# EasyEDA Pro project ProPrj_CraftVia-MakerCard-S-v1-Rev0_2026-09-30.epro, board PCB1
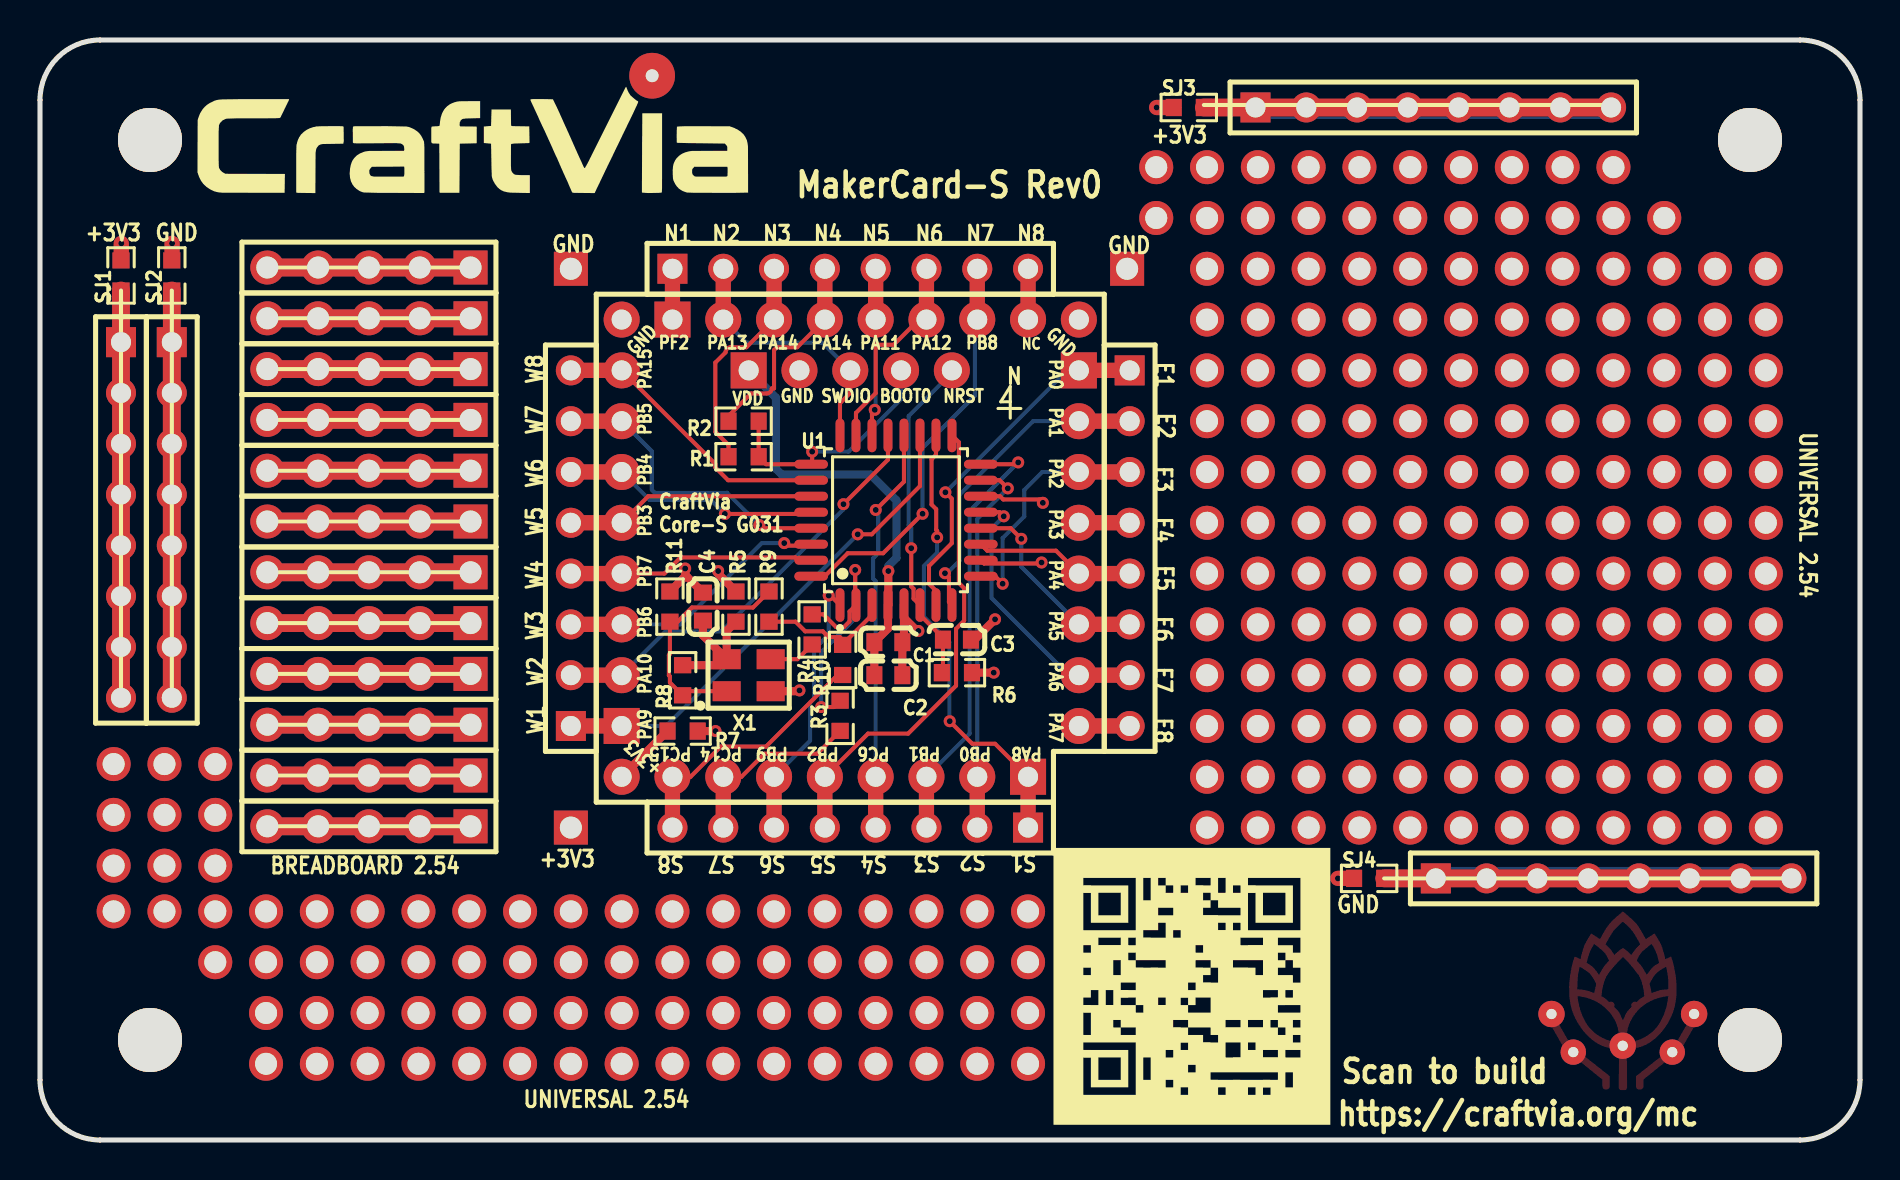
[diagram p3: board, top side]
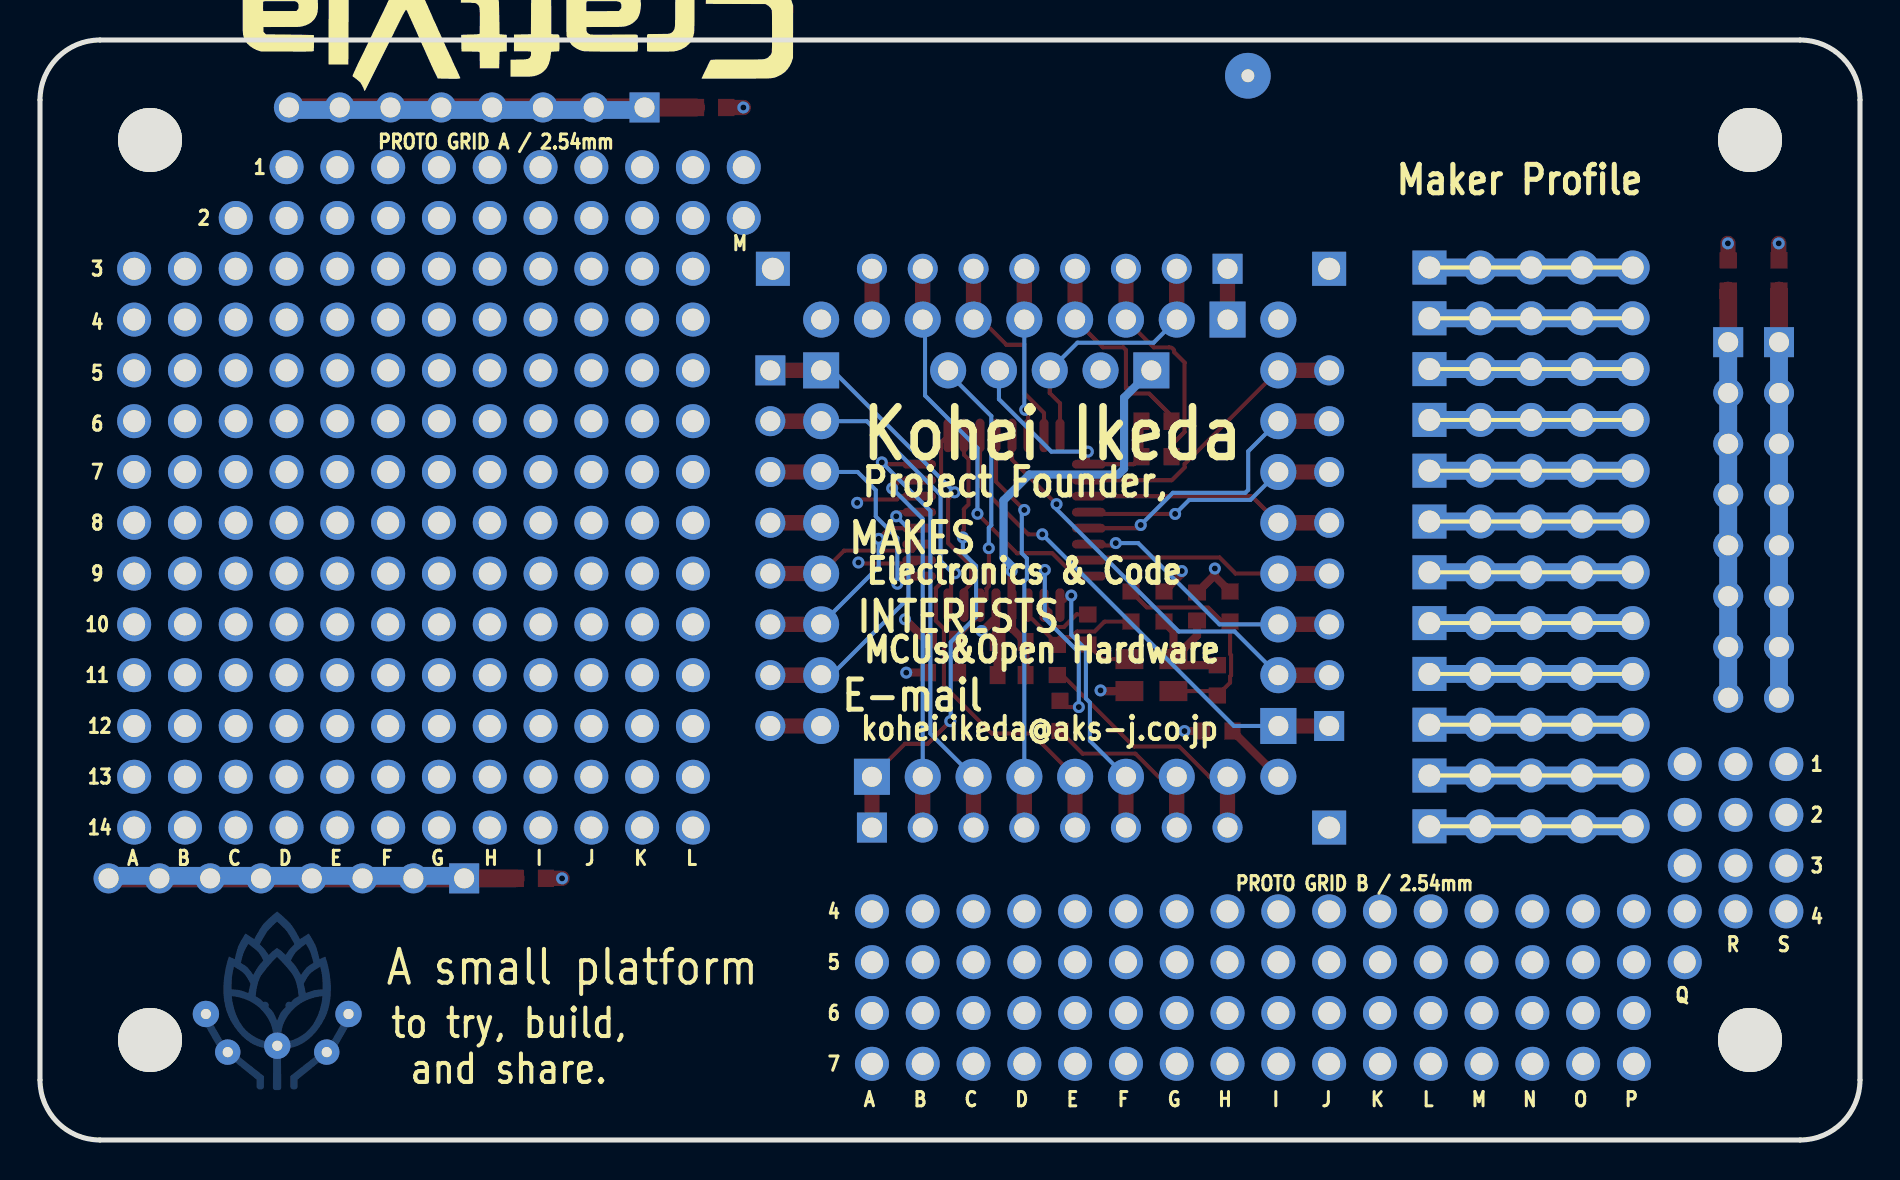
[diagram p4: board, bottom side, seen from below]

Outline 91 x 55 mm; copper layers: Top Layer, GND Plane, Power / Signal, Bottom Layer. Coordinates in mm from the lower left corner of the outline.
Outline path: 0,52 arc(0.88,54.12) 3,55 88,55 arc(90.12,54.12) 91,52 91,3 arc(90.12,0.88) 88,0 3,0 arc(0.88,0.88) 0,3 0,52
Stack: Top Layer 0.035mm Outer layer thickness 1oz / Dielectric1 0.48mm 7628 RC49% 8.6mil / GND Plane 0.035mm / Dielectric2 0.48mm 1.1mm H/HOZ Copper / Power / Signal 0.035mm / Dielectric3 0.48mm 7628 RC49% 8.6mil / Bottom Layer 0.035mm Outer layer thickness 1oz

## Design rules (mm)
spacing copperThickness1oz (default): track to track 0.152, other pairs 0.152 to 0.3
spacing copperThickness2oz: track to track 0.203, other pairs 0.152 to 0.3
track width copperThickness1oz (default): min 0.152, default 0.203, max 2.54
track width copperThickness2oz: min 0.203, default 0.254, max 2.54
track width powerTrack: min 0.254, default 0.406, max 2.54
differential pair differentialPair (default): width min 0.127, default 0.254, max 2.54; gap min 0.152, default 0.152
net VDD_CORE uses copperRegion, powerTrack
net GND uses copperRegion, powerTrack
net VDD_OSC uses powerTrack
net +3V3 uses copperRegion, powerTrack

## Placement (name value [footprint] x y rotation side)
BB1  5-HOLE STRIP BB1  [HDR-TH_5P-P2.54-V-M]  16.45 43.62 180 top
BB2  5-HOLE STRIP BB2  [HDR-TH_5P-P2.54-V-M]  16.45 41.08 180 top
BB3  5-HOLE STRIP BB3  [HDR-TH_5P-P2.54-V-M]  16.45 38.54 180 top
BB4  5-HOLE STRIP BB4  [HDR-TH_5P-P2.54-V-M]  16.45 36 180 top
BB5  5-HOLE STRIP BB5  [HDR-TH_5P-P2.54-V-M]  16.45 33.46 180 top
BB6  5-HOLE STRIP BB6  [HDR-TH_5P-P2.54-V-M]  16.45 30.92 180 top
BB7  5-HOLE STRIP BB7  [HDR-TH_5P-P2.54-V-M]  16.45 28.38 180 top
BB8  5-HOLE STRIP BB8  [HDR-TH_5P-P2.54-V-M]  16.45 25.84 180 top
BB9  5-HOLE STRIP BB9  [HDR-TH_5P-P2.54-V-M]  16.45 23.3 180 top
BB10  5-HOLE STRIP BB10  [HDR-TH_5P-P2.54-V-M]  16.45 20.76 180 top
BB11  5-HOLE STRIP BB11  [HDR-TH_5P-P2.54-V-M]  16.45 18.22 180 top
BB12  5-HOLE STRIP BB12  [HDR-TH_5P-P2.54-V-M]  16.45 15.68 180 top
BBP1  POWER RAIL A  [HDR-TH_8P-P2.54-V-M]  4.05 31 270 top
BBP2  POWER RAIL B  [HDR-TH_8P-P2.54-V-M]  6.59 31 270 top
BBP3  POWER RAIL C  [HDR-TH_8P-P2.54-V-M]  69.66 51.63 0 top
BBP4  POWER RAIL D  [HDR-TH_8P-P2.54-V-M]  78.68 13.08 0 top
C1  100nF  [C0603]  42.42 24.89 180 top
C2  4.7uF  [C0603]  42.42 23.24 180 top
C3  100nF  [C0603]  45.85 25.02 180 top
C4  10nF  [C0603]  33.15 26.67 270 top
J1  N 1-8  [HDR-TH_8P-P2.54-V-M#2]  40.51 41.02 0 top
J2  E 1-8  [HDR-TH_8P-P2.54-V-M#2]  51.94 29.59 270 top
J3  S 1-8  [HDR-TH_8P-P2.54-V-M#2]  40.51 18.16 180 top
J4  W 1-8  [HDR-TH_8P-P2.54-V-M#2]  29.08 29.59 90 top
J5  K-NW  [HDR-TH_1P-P2.54-V-M]  29.08 41.02 0 top
J6  K-NE  [HDR-TH_1P-P2.54-V-M]  51.94 41.02 0 top
J7  K-SW  [HDR-TH_1P-P2.54-V-M]  29.08 18.16 0 top
J8  N BREAKOUT  [HDR-TH_8P-P2.54-V-M]  40.51 43.56 0 top
J9  E BREAKOUT  [HDR-TH_8P-P2.54-V-M]  54.48 29.59 270 top
J10  S BREAKOUT  [HDR-TH_8P-P2.54-V-M]  40.51 15.62 180 top
J11  W BREAKOUT  [HDR-TH_8P-P2.54-V-M]  26.54 29.59 90 top
J12  K-NW BREAKOUT  [HDR-TH_1P-P2.54-V-M#2]  26.54 43.56 0 top
J13  K-NE BREAKOUT  [HDR-TH_1P-P2.54-V-M#2]  54.36 43.56 0 top
J14  K-SW BREAKOUT  [HDR-TH_1P-P2.54-V-M#2]  26.54 15.62 0 top
NOREF  -  [Pad_e851]  6.22 16.26 0 top
NOREF#2  -  [Pad_e753]  65.97 30.86 0 top
NOREF#3  -  [Pad_e650]  21.46 8.89 0 top
NOREF#4  -  [Pad_e829]  76.13 46.1 0 top
NOREF#5  -  [Pad_e729]  65.97 25.78 0 top
NOREF#6  -  [Pad_e714]  58.35 23.24 0 top
NOREF#7  -  [Pad_e1135]  75.57 6.3 0 top
NOREF#8  -  [Pad_e804]  73.59 41.02 0 top
NOREF#9  -  [Pad_e833]  60.89 48.64 0 top
NOREF#10  -  [Pad_e754]  68.51 30.86 0 top
NOREF#11  -  [Pad_e769]  76.13 33.4 0 top
NOREF#12  -  [Pad_e764]  63.43 33.4 0 top
NOREF#13  -  [Pad_e788]  63.43 38.48 0 top
NOREF#14  -  [Pad_e800]  63.43 41.02 0 top
NOREF#15  -  [Pad_e795]  81.21 38.48 0 top
NOREF#16  -  [Pad_e712]  83.75 20.7 0 top
NOREF#17  -  [Pad_e699]  81.21 18.16 0 top
NOREF#18  -  [Pad_e1034]  6.22 18.8 0 top
NOREF#19  -  [Pad_e620]  21.46 3.81 0 top
NOREF#20  -  [Pad_e848]  6.22 13.72 0 top
NOREF#21  -  [Pad_e808]  83.75 41.02 0 top
NOREF#22  -  [Pad_e662]  11.3 11.43 0 top
NOREF#23  -  [Pad_e787]  60.89 38.48 0 top
NOREF#24  -  [Pad_e645]  44.32 6.35 0 top
NOREF#25  -  [Pad_e762]  58.35 33.4 0 top
NOREF#26  -  [Pad_e621]  24 3.81 0 top
NOREF#27  -  [Pad_e827]  71.05 46.1 0 top
NOREF#28  -  [Pad_e778]  68.51 35.94 0 top
NOREF#29  -  [Pad_e786]  58.35 38.48 0 top
NOREF#30  -  [Pad_e678]  58.35 15.62 0 top
NOREF#31  -  [Pad_e683]  71.05 15.62 0 top
NOREF#32  -  [Pad_e728]  63.43 25.78 0 top
NOREF#33  -  [Pad_e716]  63.43 23.24 0 top
NOREF#34  -  [Pad_e624]  31.62 3.81 0 top
NOREF#35  -  [Pad_e1137]  79.14 4.71 0 top
NOREF#36  -  [Pad_e622]  26.54 3.81 0 top
NOREF#37  -  [Pad_e802]  68.51 41.02 0 top
NOREF#38  -  [Pad_e734]  78.67 25.78 0 top
NOREF#39  -  [Pad_e745]  76.13 28.32 0 top
NOREF#40  -  [Pad_e623]  29.08 3.81 0 top
NOREF#41  -  [Pad_e806]  78.67 41.02 0 top
NOREF#42  -  [Pad_e631]  49.4 3.81 0 top
NOREF#43  -  [Pad_e832]  58.35 48.64 0 top
NOREF#44  -  [Pad_e627]  39.24 3.81 0 top
NOREF#45  -  [Pad_e703]  60.89 20.7 0 top
NOREF#46  -  [Pad_e634]  16.38 6.35 0 top
NOREF#47  -  [Pad_e666]  21.46 11.43 0 top
NOREF#48  -  [Pad_e1136]  82.71 6.3 0 top
NOREF#49  -  [Pad_e835]  65.97 48.64 0 top
NOREF#50  -  [Pad_e689]  86.29 15.62 0 top
NOREF#51  -  [Pad_e775]  60.89 35.94 0 top
NOREF#52  -  [Pad_e790]  68.51 38.48 0 top
NOREF#53  -  [Pad_e774]  58.35 35.94 0 top
NOREF#54  -  [Pad_e682]  68.51 15.62 0 top
NOREF#55  -  [Pad_e687]  81.21 15.62 0 top
NOREF#56  -  [Pad_e637]  24 6.35 0 top
NOREF#57  -  [Pad_e657]  39.24 8.89 0 top
NOREF#58  -  [Pad_e779]  71.05 35.94 0 top
NOREF#59  -  [Pad_e630]  46.86 3.81 0 top
NOREF#60  -  [Pad_e841]  8.76 8.89 0 top
NOREF#61  -  [Pad_e669]  29.08 11.43 0 top
NOREF#62  -  [Pad_e736]  83.75 25.78 0 top
NOREF#63  -  [Pad_e783]  81.21 35.94 0 top
NOREF#64  -  [Pad_e777]  65.97 35.94 0 top
NOREF#65  -  [Pad_e708]  73.59 20.7 0 top
NOREF#66  -  [Pad_e844]  6.22 11.43 0 top
NOREF#67  -  [Pad_e755]  71.05 30.86 0 top
NOREF#68  -  [Pad_e751]  60.89 30.86 0 top
NOREF#69  -  [Pad_e617]  13.84 3.81 0 top
NOREF#70  -  [Pad_e742]  68.51 28.32 0 top
NOREF#71  -  [Pad_e706]  68.51 20.7 0 top
NOREF#72  -  [Pad_e763]  60.89 33.4 0 top
NOREF#73  -  [Pad_e671]  34.16 11.43 0 top
NOREF#74  -  [Pad_e817]  76.13 43.56 0 top
NOREF#75  -  [Pad_e792]  73.59 38.48 0 top
NOREF#76  -  [Pad_e700]  83.75 18.16 0 top
NOREF#77  -  [Pad_e776]  63.43 35.94 0 top
NOREF#78  -  [Pad_e723]  81.21 23.24 0 top
NOREF#79  -  [Pad_e665]  18.92 11.43 0 top
NOREF#80  -  [Pad_e720]  73.59 23.24 0 top
NOREF#81  -  [Pad_e692]  63.43 18.16 0 top
NOREF#82  -  [Pad_e668]  26.54 11.43 0 top
NOREF#83  -  [Pad_e852]  3.68 16.26 0 top
NOREF#84  -  [Pad_e647]  49.4 6.35 0 top
NOREF#85  -  [Pad_e664]  16.38 11.43 0 top
NOREF#86  -  [Pad_e773]  86.29 33.4 0 top
NOREF#87  -  [Pad_e688]  83.75 15.62 0 top
NOREF#88  -  [Pad_e701]  86.29 18.16 0 top
NOREF#89  -  [Pad_e644]  41.78 6.35 0 top
NOREF#90  -  [Pad_e674]  41.78 11.43 0 top
NOREF#91  -  [Pad_e743]  71.05 28.32 0 top
NOREF#92  -  [Pad_e760]  83.75 30.86 0 top
NOREF#93  -  [Pad_e824]  63.43 46.1 0 top
NOREF#94  -  [Pad_e811]  60.89 43.56 0 top
NOREF#95  -  [Pad_e750]  58.35 30.86 0 top
NOREF#96  -  [Pad_e818]  78.67 43.56 0 top
NOREF#97  -  [Pad_e850]  8.76 16.26 0 top
NOREF#98  -  [Pad_e619]  18.92 3.81 0 top
NOREF#99  -  [Pad_e724]  83.75 23.24 0 top
NOREF#100  -  [Pad_e801]  65.97 41.02 0 top
NOREF#101  -  [Pad_e780]  73.59 35.94 0 top
NOREF#102  -  [Pad_e684]  73.59 15.62 0 top
NOREF#103  -  [Pad_e794]  78.67 38.48 0 top
NOREF#104  -  [Pad_e667]  24 11.43 0 top
NOREF#105  -  [Pad_e722]  78.67 23.24 0 top
NOREF#106  -  [Pad_e812]  63.43 43.56 0 top
NOREF#107  -  [Pad_e709]  76.13 20.7 0 top
NOREF#108  -  [Pad_e796]  83.75 38.48 0 top
NOREF#109  -  [Pad_e571]  5.5 50 0 top
NOREF#110  -  [Pad_e672]  36.7 11.43 0 top
NOREF#111  -  [Pad_e679]  60.89 15.62 0 top
NOREF#112  -  [Pad_e785]  86.29 35.94 0 top
NOREF#113  -  [Pad_e648]  16.38 8.89 0 top
NOREF#114  -  [Pad_e759]  81.21 30.86 0 top
NOREF#115  -  [Pad_e698]  78.67 18.16 0 top
NOREF#116  -  [Pad_e809]  86.29 41.02 0 top
NOREF#117  -  [Pad_e727]  60.89 25.78 0 top
NOREF#118  -  [Pad_e772]  83.75 33.4 0 top
NOREF#119  -  [Pad_e654]  31.62 8.89 0 top
NOREF#120  -  [Pad_e803]  71.05 41.02 0 top
NOREF#121  -  [Pad_e837]  71.05 48.64 0 top
NOREF#122  -  [Pad_e616]  11.3 3.81 0 top
NOREF#123  -  [Pad_e696]  73.59 18.16 0 top
NOREF#124  -  [Pad_e710]  78.67 20.7 0 top
NOREF#125  -  [Pad_e782]  78.67 35.94 0 top
NOREF#126  -  [Pad_e828]  73.59 46.1 0 top
NOREF#127  -  [Pad_e638]  26.54 6.35 0 top
NOREF#128  -  [Pad_e746]  78.67 28.32 0 top
NOREF#129  -  [Pad_e639]  29.08 6.35 0 top
NOREF#130  -  [Pad_e730]  68.51 25.78 0 top
NOREF#131  -  [Pad_e702]  58.35 20.7 0 top
NOREF#132  -  [Pad_e651]  24 8.89 0 top
NOREF#133  -  [Pad_e767]  71.05 33.4 0 top
NOREF#134  -  [Pad_e840]  78.67 48.64 0 top
NOREF#135  -  [Pad_e686]  78.67 15.62 0 top
NOREF#136  -  [Pad_e675]  44.32 11.43 0 top
NOREF#137  -  [Pad_e836]  68.51 48.64 0 top
NOREF#138  -  [Pad_e626]  36.7 3.81 0 top
NOREF#139  -  [Pad_e695]  71.05 18.16 0 top
NOREF#140  -  [Pad_e726]  58.35 25.78 0 top
NOREF#141  -  [Pad_e725]  86.29 23.24 0 top
NOREF#142  -  [Pad_e663]  13.84 11.43 0 top
NOREF#143  -  [Pad_e649]  18.92 8.89 0 top
NOREF#144  -  [Pad_e641]  34.16 6.35 0 top
NOREF#145  -  [Pad_e747]  81.21 28.32 0 top
NOREF#146  -  [Pad_e797]  86.29 38.48 0 top
NOREF#147  -  [Pad_e670]  31.62 11.43 0 top
NOREF#148  -  [Pad_e704]  63.43 20.7 0 top
NOREF#149  -  [Pad_e830]  78.67 46.1 0 top
NOREF#150  -  [Pad_e635]  18.92 6.35 0 top
NOREF#151  -  [Pad_e659]  44.32 8.89 0 top
NOREF#152  -  [Pad_e816]  73.59 43.56 0 top
NOREF#153  -  [Pad_e822]  58.35 46.1 0 top
NOREF#154  -  [Pad_e658]  41.78 8.89 0 top
NOREF#155  -  [Pad_e636]  21.46 6.35 0 top
NOREF#156  -  [Pad_e693]  65.97 18.16 0 top
NOREF#157  -  [Pad_e660]  46.86 8.89 0 top
NOREF#158  -  [Pad_e758]  78.67 30.86 0 top
NOREF#159  -  [Pad_e569]  5.5 5 0 top
NOREF#160  -  [Pad_e1033]  8.76 18.8 0 top
NOREF#161  -  [Pad_e791]  71.05 38.48 0 top
NOREF#162  -  [Pad_e810]  58.35 43.56 0 top
NOREF#163  -  [Pad_e673]  39.24 11.43 0 top
NOREF#164  -  [Pad_e711]  81.21 20.7 0 top
NOREF#165  -  [Pad_e834]  63.43 48.64 0 top
NOREF#166  -  [Pad_e748]  83.75 28.32 0 top
NOREF#167  -  [Pad_e1139]  81.61 4.39 0 top
NOREF#168  -  [Pad_e846]  13.84 8.89 0 top
NOREF#169  -  [Pad_e842]  3.68 11.43 0 top
NOREF#170  -  [Pad_e629]  44.32 3.81 0 top
NOREF#171  -  [Pad_e656]  36.7 8.89 0 top
NOREF#172  -  [Pad_e815]  71.05 43.56 0 top
NOREF#173  -  [Pad_e707]  71.05 20.7 0 top
NOREF#174  -  [Pad_e847]  8.76 13.72 0 top
NOREF#175  -  [Pad_e628]  41.78 3.81 0 top
NOREF#176  -  [Pad_e819]  81.21 43.56 0 top
NOREF#177  -  [Pad_e694]  68.51 18.16 0 top
NOREF#178  -  [Pad_e752]  63.43 30.86 0 top
NOREF#179  -  [Pad_e1132]  30.61 53.21 0 top
NOREF#180  -  [Pad_e732]  73.59 25.78 0 top
NOREF#181  -  [Pad_e771]  81.21 33.4 0 top
NOREF#182  -  [Pad_e789]  65.97 38.48 0 top
NOREF#183  -  [Pad_e677]  49.4 11.43 0 top
NOREF#184  -  [Pad_e1036]  55.81 46.1 0 top
NOREF#185  -  [Pad_e749]  86.29 28.32 0 top
NOREF#186  -  [Pad_e721]  76.13 23.24 0 top
NOREF#187  -  [Pad_e652]  26.54 8.89 0 top
NOREF#188  -  [Pad_e768]  73.59 33.4 0 top
NOREF#189  -  [Pad_e633]  13.84 6.35 0 top
NOREF#190  -  [Pad_e831]  81.21 46.1 0 top
NOREF#191  -  [Pad_e691]  60.89 18.16 0 top
NOREF#192  -  [Pad_e770]  78.67 33.4 0 top
NOREF#193  -  [Pad_e813]  65.97 43.56 0 top
NOREF#194  -  [Pad_e661]  49.4 8.89 0 top
NOREF#195  -  [Pad_e805]  76.13 41.02 0 top
NOREF#196  -  [Pad_e845]  11.3 8.89 0 top
NOREF#197  -  [Pad_e807]  81.21 41.02 0 top
NOREF#198  -  [Pad_e735]  81.21 25.78 0 top
NOREF#199  -  [Pad_e825]  65.97 46.1 0 top
NOREF#200  -  [Pad_e784]  83.75 35.94 0 top
NOREF#201  -  [Pad_e719]  71.05 23.24 0 top
NOREF#202  -  [Pad_e653]  29.08 8.89 0 top
NOREF#203  -  [Pad_e757]  76.13 30.86 0 top
NOREF#204  -  [Pad_e572]  85.5 50 0 top
NOREF#205  -  [Pad_e642]  36.7 6.35 0 top
NOREF#206  -  [Pad_e717]  65.97 23.24 0 top
NOREF#207  -  [Pad_e821]  86.29 43.56 0 top
NOREF#208  -  [Pad_e643]  39.24 6.35 0 top
NOREF#209  -  [Pad_e731]  71.05 25.78 0 top
NOREF#210  -  [Pad_e1035]  55.81 48.64 0 top
NOREF#211  -  [Pad_e713]  86.29 20.7 0 top
NOREF#212  -  [Pad_e781]  76.13 35.94 0 top
NOREF#213  -  [Pad_e737]  86.29 25.78 0 top
NOREF#214  -  [Pad_e680]  63.43 15.62 0 top
NOREF#215  -  [Pad_e799]  60.89 41.02 0 top
NOREF#216  -  [Pad_e739]  60.89 28.32 0 top
NOREF#217  -  [Pad_e646]  46.86 6.35 0 top
NOREF#218  -  [Pad_e814]  68.51 43.56 0 top
NOREF#219  -  [Pad_e705]  65.97 20.7 0 top
NOREF#220  -  [Pad_e570]  85.5 5 0 top
NOREF#221  -  [Pad_e761]  86.29 30.86 0 top
NOREF#222  -  [Pad_e718]  68.51 23.24 0 top
NOREF#223  -  [Pad_e733]  76.13 25.78 0 top
NOREF#224  -  [Pad_e798]  58.35 41.02 0 top
NOREF#225  -  [Pad_e1032]  3.68 18.8 0 top
NOREF#226  -  [Pad_e744]  73.59 28.32 0 top
NOREF#227  -  [Pad_e820]  83.75 43.56 0 top
NOREF#228  -  [Pad_e690]  58.35 18.16 0 top
NOREF#229  -  [Pad_e823]  60.89 46.1 0 top
NOREF#230  -  [Pad_e625]  34.16 3.81 0 top
NOREF#231  -  [Pad_e632]  11.3 6.35 0 top
NOREF#232  -  [Pad_e843]  8.76 11.43 0 top
NOREF#233  -  [Pad_e766]  68.51 33.4 0 top
NOREF#234  -  [Pad_e618]  16.38 3.81 0 top
NOREF#235  -  [Pad_e676]  46.86 11.43 0 top
NOREF#236  -  [Pad_e655]  34.16 8.89 0 top
NOREF#237  -  [Pad_e765]  65.97 33.4 0 top
NOREF#238  -  [Pad_e1138]  76.66 4.39 0 top
NOREF#239  -  [Pad_e740]  63.43 28.32 0 top
NOREF#240  -  [Pad_e793]  76.13 38.48 0 top
NOREF#241  -  [Pad_e839]  76.13 48.64 0 top
NOREF#242  -  [Pad_e741]  65.97 28.32 0 top
NOREF#243  -  [Pad_e849]  3.68 13.72 0 top
NOREF#244  -  [Pad_e640]  31.62 6.35 0 top
NOREF#245  -  [Pad_e715]  60.89 23.24 0 top
NOREF#246  -  [Pad_e697]  76.13 18.16 0 top
NOREF#247  -  [Pad_e838]  73.59 48.64 0 top
NOREF#248  -  [Pad_e756]  73.59 30.86 0 top
NOREF#249  -  [Pad_e738]  58.35 28.32 0 top
NOREF#250  -  [Pad_e681]  65.97 15.62 0 top
NOREF#251  -  [Pad_e685]  76.13 15.62 0 top
NOREF#252  -  [Pad_e826]  68.51 46.1 0 top
R1  33Ω  [R0603]  35.18 34.16 0 top
R2  1kΩ  [R0603]  35.18 35.94 0 top
R3  0Ω  [R0603]  40 21.21 90 top
R4  33Ω  [R0603]  38.61 25.53 90 top
R5  0Ω  [R0603]  34.8 26.67 270 top
R6  10kΩ  [R0603]  45.85 23.37 180 top
R7  0Ω  [R0603]  32.13 20.45 0 top
R8  0Ω  [R0603]  32.13 22.99 270 top
R9  0Ω  [R0603]  36.45 26.67 90 top
R10  0Ω  [R0603]  40.13 24 90 top
R11  10kΩ  [R0603]  31.5 26.67 90 top
SJ1  0Ω  [R0603]  4.05 43.23 270 top
SJ2  0Ω  [R0603]  6.59 43.23 270 top
SJ3  0Ω  [R0603]  57.44 51.62 0 top
SJ4  0Ω  [R0603]  66.46 13.08 0 top
TP1  VTREF  [HDR-TH_1P-P2.54-V-M#3]  35.43 38.48 0 top
TP2  GND  [HDR-TH_1P-P2.54-V-M]  37.97 38.48 0 top
TP3  SWDIO  [HDR-TH_1P-P2.54-V-M]  40.51 38.48 0 top
TP4  SWCLK  [HDR-TH_1P-P2.54-V-M]  43.05 38.48 0 top
TP5  NRST  [HDR-TH_1P-P2.54-V-M]  45.59 38.48 0 top
U1  STM32G031K8T6  [LQFP-32_L7.0-W7.0-P0.80-LS9.0-BL]  42.8 30.99 0 top
X1  8MHz  [CraftVia_ASEDVN_3225_4P]  35.43 23.24 0 top

## Footprints (pads in the part's own frame, mm; a bottom-side part is the same pattern mirrored in y, then rotated)
C0603
  rect 0.8x0.9 smd: 1(-0.7,0) 2(0.7,0)
CraftVia_ASEDVN_3225_4P
  rect 1.4x1 smd: 1(-1.1,-0.8) 2(1.1,-0.8) 3(1.1,0.8) 4(-1.1,0.8)
HDR-TH_1P-P2.54-V-M
  round 1.801 hole 1.001: 1(0,0)
HDR-TH_1P-P2.54-V-M#2
  rect 1.7x1.7 hole 1.1: 1(0,0)
HDR-TH_1P-P2.54-V-M#3
  rect 1.801x1.801 hole 1: 1(0,0)
HDR-TH_5P-P2.54-V-M
  rect 1.7x1.7 hole 1.1: 1(-5.08,0)
  round 1.7 hole 1.1: 2(-2.54,0) 3(0,0) 4(2.54,0) 5(5.08,0)
HDR-TH_8P-P2.54-V-M
  rect 1.5x1.5 hole 1: 1(-8.89,0)
  round 1.5 hole 1: 2(-6.35,0) 3(-3.81,0) 4(-1.27,0) 5(1.27,0) 6(3.81,0) 7(6.35,0) 8(8.89,0)
HDR-TH_8P-P2.54-V-M#2
  rect 1.801x1.801 hole 1: 1(-8.89,0)
  round 1.801 hole 1: 2(-6.35,0) 3(-3.81,0) 4(-1.27,0) 5(1.27,0) 6(3.81,0) 7(6.35,0) 8(8.89,0)
LQFP-32_L7.0-W7.0-P0.80-LS9.0-BL
  oval 0.448x1.684 smd: 1(-2.8,-4.242) 2(-2,-4.242) 3(-1.2,-4.242) 4(-0.4,-4.242) 5(0.4,-4.242) 6(1.2,-4.242) 7(2,-4.242) 8(2.8,-4.242) 17(2.8,4.242) 18(2,4.242) 19(1.2,4.242) 20(0.4,4.242) 21(-0.4,4.242) 22(-1.2,4.242) 23(-2,4.242) 24(-2.8,4.242)
  oval 1.684x0.448 smd: 9(4.242,-2.8) 10(4.242,-2) 11(4.242,-1.2) 12(4.242,-0.4) 13(4.242,0.4) 14(4.242,1.2) 15(4.242,2) 16(4.242,2.8) 25(-4.242,2.8) 26(-4.242,2) 27(-4.242,1.2) 28(-4.242,0.4) 29(-4.242,-0.4) 30(-4.242,-1.2) 31(-4.242,-2) 32(-4.242,-2.8)
Pad_e569
  round 3.2 hole 3.2: MH1(0,0)
Pad_e570
  round 3.2 hole 3.2: MH2(0,0)
Pad_e571
  round 3.2 hole 3.2: MH3(0,0)
Pad_e572
  round 3.2 hole 3.2: MH4(0,0)
Pad_e616
  round 1.7 hole 1.1: SP4_01_01(0,0)
Pad_e617
  round 1.7 hole 1.1: SP4_01_02(0,0)
Pad_e618
  round 1.7 hole 1.1: SP4_01_03(0,0)
Pad_e619
  round 1.7 hole 1.1: SP4_01_04(0,0)
Pad_e620
  round 1.7 hole 1.1: SP4_01_05(0,0)
Pad_e621
  round 1.7 hole 1.1: SP4_01_06(0,0)
Pad_e622
  round 1.7 hole 1.1: SP4_01_07(0,0)
Pad_e623
  round 1.7 hole 1.1: SP4_01_08(0,0)
Pad_e624
  round 1.7 hole 1.1: SP4_01_09(0,0)
Pad_e625
  round 1.7 hole 1.1: SP4_01_10(0,0)
Pad_e626
  round 1.7 hole 1.1: SP4_01_11(0,0)
Pad_e627
  round 1.7 hole 1.1: SP4_01_12(0,0)
Pad_e628
  round 1.7 hole 1.1: SP4_01_13(0,0)
Pad_e629
  round 1.7 hole 1.1: SP4_01_14(0,0)
Pad_e630
  round 1.7 hole 1.1: SP4_01_15(0,0)
Pad_e631
  round 1.7 hole 1.1: SP4_01_16(0,0)
Pad_e632
  round 1.7 hole 1.1: SP4_02_01(0,0)
Pad_e633
  round 1.7 hole 1.1: SP4_02_02(0,0)
Pad_e634
  round 1.7 hole 1.1: SP4_02_03(0,0)
Pad_e635
  round 1.7 hole 1.1: SP4_02_04(0,0)
Pad_e636
  round 1.7 hole 1.1: SP4_02_05(0,0)
Pad_e637
  round 1.7 hole 1.1: SP4_02_06(0,0)
Pad_e638
  round 1.7 hole 1.1: SP4_02_07(0,0)
Pad_e639
  round 1.7 hole 1.1: SP4_02_08(0,0)
Pad_e640
  round 1.7 hole 1.1: SP4_02_09(0,0)
Pad_e641
  round 1.7 hole 1.1: SP4_02_10(0,0)
Pad_e642
  round 1.7 hole 1.1: SP4_02_11(0,0)
Pad_e643
  round 1.7 hole 1.1: SP4_02_12(0,0)
Pad_e644
  round 1.7 hole 1.1: SP4_02_13(0,0)
Pad_e645
  round 1.7 hole 1.1: SP4_02_14(0,0)
Pad_e646
  round 1.7 hole 1.1: SP4_02_15(0,0)
Pad_e647
  round 1.7 hole 1.1: SP4_02_16(0,0)
Pad_e648
  round 1.7 hole 1.1: SP4_03_03(0,0)
Pad_e649
  round 1.7 hole 1.1: SP4_03_04(0,0)
Pad_e650
  round 1.7 hole 1.1: SP4_03_05(0,0)
Pad_e651
  round 1.7 hole 1.1: SP4_03_06(0,0)
Pad_e652
  round 1.7 hole 1.1: SP4_03_07(0,0)
Pad_e653
  round 1.7 hole 1.1: SP4_03_08(0,0)
Pad_e654
  round 1.7 hole 1.1: SP4_03_09(0,0)
Pad_e655
  round 1.7 hole 1.1: SP4_03_10(0,0)
Pad_e656
  round 1.7 hole 1.1: SP4_03_11(0,0)
Pad_e657
  round 1.7 hole 1.1: SP4_03_12(0,0)
Pad_e658
  round 1.7 hole 1.1: SP4_03_13(0,0)
Pad_e659
  round 1.7 hole 1.1: SP4_03_14(0,0)
Pad_e660
  round 1.7 hole 1.1: SP4_03_15(0,0)
Pad_e661
  round 1.7 hole 1.1: SP4_03_16(0,0)
Pad_e662
  round 1.7 hole 1.1: SP4_04_01(0,0)
Pad_e663
  round 1.7 hole 1.1: SP4_04_02(0,0)
Pad_e664
  round 1.7 hole 1.1: SP4_04_03(0,0)
Pad_e665
  round 1.7 hole 1.1: SP4_04_04(0,0)
Pad_e666
  round 1.7 hole 1.1: SP4_04_05(0,0)
Pad_e667
  round 1.7 hole 1.1: SP4_04_06(0,0)
Pad_e668
  round 1.7 hole 1.1: SP4_04_07(0,0)
Pad_e669
  round 1.7 hole 1.1: SP4_04_08(0,0)
Pad_e670
  round 1.7 hole 1.1: SP4_04_09(0,0)
Pad_e671
  round 1.7 hole 1.1: SP4_04_10(0,0)
Pad_e672
  round 1.7 hole 1.1: SP4_04_11(0,0)
Pad_e673
  round 1.7 hole 1.1: SP4_04_12(0,0)
Pad_e674
  round 1.7 hole 1.1: SP4_04_13(0,0)
Pad_e675
  round 1.7 hole 1.1: SP4_04_14(0,0)
Pad_e676
  round 1.7 hole 1.1: SP4_04_15(0,0)
Pad_e677
  round 1.7 hole 1.1: SP4_04_16(0,0)
Pad_e678
  round 1.7 hole 1.1: UV2_01_01(0,0)
Pad_e679
  round 1.7 hole 1.1: UV2_01_02(0,0)
Pad_e680
  round 1.7 hole 1.1: UV2_01_03(0,0)
Pad_e681
  round 1.7 hole 1.1: UV2_01_04(0,0)
Pad_e682
  round 1.7 hole 1.1: UV2_01_05(0,0)
Pad_e683
  round 1.7 hole 1.1: UV2_01_06(0,0)
Pad_e684
  round 1.7 hole 1.1: UV2_01_07(0,0)
Pad_e685
  round 1.7 hole 1.1: UV2_01_08(0,0)
Pad_e686
  round 1.7 hole 1.1: UV2_01_09(0,0)
Pad_e687
  round 1.7 hole 1.1: UV2_01_10(0,0)
Pad_e688
  round 1.7 hole 1.1: UV2_01_11(0,0)
Pad_e689
  round 1.7 hole 1.1: UV2_01_12(0,0)
Pad_e690
  round 1.7 hole 1.1: UV2_02_01(0,0)
Pad_e691
  round 1.7 hole 1.1: UV2_02_02(0,0)
Pad_e692
  round 1.7 hole 1.1: UV2_02_03(0,0)
Pad_e693
  round 1.7 hole 1.1: UV2_02_04(0,0)
Pad_e694
  round 1.7 hole 1.1: UV2_02_05(0,0)
Pad_e695
  round 1.7 hole 1.1: UV2_02_06(0,0)
Pad_e696
  round 1.7 hole 1.1: UV2_02_07(0,0)
Pad_e697
  round 1.7 hole 1.1: UV2_02_08(0,0)
Pad_e698
  round 1.7 hole 1.1: UV2_02_09(0,0)
Pad_e699
  round 1.7 hole 1.1: UV2_02_10(0,0)
Pad_e700
  round 1.7 hole 1.1: UV2_02_11(0,0)
Pad_e701
  round 1.7 hole 1.1: UV2_02_12(0,0)
Pad_e702
  round 1.7 hole 1.1: UV2_03_01(0,0)
Pad_e703
  round 1.7 hole 1.1: UV2_03_02(0,0)
Pad_e704
  round 1.7 hole 1.1: UV2_03_03(0,0)
Pad_e705
  round 1.7 hole 1.1: UV2_03_04(0,0)
Pad_e706
  round 1.7 hole 1.1: UV2_03_05(0,0)
Pad_e707
  round 1.7 hole 1.1: UV2_03_06(0,0)
Pad_e708
  round 1.7 hole 1.1: UV2_03_07(0,0)
Pad_e709
  round 1.7 hole 1.1: UV2_03_08(0,0)
Pad_e710
  round 1.7 hole 1.1: UV2_03_09(0,0)
Pad_e711
  round 1.7 hole 1.1: UV2_03_10(0,0)
Pad_e712
  round 1.7 hole 1.1: UV2_03_11(0,0)
Pad_e713
  round 1.7 hole 1.1: UV2_03_12(0,0)
Pad_e714
  round 1.7 hole 1.1: UV2_04_01(0,0)
Pad_e715
  round 1.7 hole 1.1: UV2_04_02(0,0)
Pad_e716
  round 1.7 hole 1.1: UV2_04_03(0,0)
Pad_e717
  round 1.7 hole 1.1: UV2_04_04(0,0)
Pad_e718
  round 1.7 hole 1.1: UV2_04_05(0,0)
Pad_e719
  round 1.7 hole 1.1: UV2_04_06(0,0)
Pad_e720
  round 1.7 hole 1.1: UV2_04_07(0,0)
Pad_e721
  round 1.7 hole 1.1: UV2_04_08(0,0)
Pad_e722
  round 1.7 hole 1.1: UV2_04_09(0,0)
Pad_e723
  round 1.7 hole 1.1: UV2_04_10(0,0)
Pad_e724
  round 1.7 hole 1.1: UV2_04_11(0,0)
Pad_e725
  round 1.7 hole 1.1: UV2_04_12(0,0)
Pad_e726
  round 1.7 hole 1.1: UV2_05_01(0,0)
Pad_e727
  round 1.7 hole 1.1: UV2_05_02(0,0)
Pad_e728
  round 1.7 hole 1.1: UV2_05_03(0,0)
Pad_e729
  round 1.7 hole 1.1: UV2_05_04(0,0)
Pad_e730
  round 1.7 hole 1.1: UV2_05_05(0,0)
Pad_e731
  round 1.7 hole 1.1: UV2_05_06(0,0)
Pad_e732
  round 1.7 hole 1.1: UV2_05_07(0,0)
Pad_e733
  round 1.7 hole 1.1: UV2_05_08(0,0)
Pad_e734
  round 1.7 hole 1.1: UV2_05_09(0,0)
Pad_e735
  round 1.7 hole 1.1: UV2_05_10(0,0)
Pad_e736
  round 1.7 hole 1.1: UV2_05_11(0,0)
Pad_e737
  round 1.7 hole 1.1: UV2_05_12(0,0)
Pad_e738
  round 1.7 hole 1.1: UV2_06_01(0,0)
Pad_e739
  round 1.7 hole 1.1: UV2_06_02(0,0)
Pad_e740
  round 1.7 hole 1.1: UV2_06_03(0,0)
Pad_e741
  round 1.7 hole 1.1: UV2_06_04(0,0)
Pad_e742
  round 1.7 hole 1.1: UV2_06_05(0,0)
Pad_e743
  round 1.7 hole 1.1: UV2_06_06(0,0)
Pad_e744
  round 1.7 hole 1.1: UV2_06_07(0,0)
Pad_e745
  round 1.7 hole 1.1: UV2_06_08(0,0)
Pad_e746
  round 1.7 hole 1.1: UV2_06_09(0,0)
Pad_e747
  round 1.7 hole 1.1: UV2_06_10(0,0)
Pad_e748
  round 1.7 hole 1.1: UV2_06_11(0,0)
Pad_e749
  round 1.7 hole 1.1: UV2_06_12(0,0)
Pad_e750
  round 1.7 hole 1.1: UV2_07_01(0,0)
Pad_e751
  round 1.7 hole 1.1: UV2_07_02(0,0)
Pad_e752
  round 1.7 hole 1.1: UV2_07_03(0,0)
Pad_e753
  round 1.7 hole 1.1: UV2_07_04(0,0)
Pad_e754
  round 1.7 hole 1.1: UV2_07_05(0,0)
Pad_e755
  round 1.7 hole 1.1: UV2_07_06(0,0)
Pad_e756
  round 1.7 hole 1.1: UV2_07_07(0,0)
Pad_e757
  round 1.7 hole 1.1: UV2_07_08(0,0)
Pad_e758
  round 1.7 hole 1.1: UV2_07_09(0,0)
Pad_e759
  round 1.7 hole 1.1: UV2_07_10(0,0)
Pad_e760
  round 1.7 hole 1.1: UV2_07_11(0,0)
Pad_e761
  round 1.7 hole 1.1: UV2_07_12(0,0)
Pad_e762
  round 1.7 hole 1.1: UV2_08_01(0,0)
Pad_e763
  round 1.7 hole 1.1: UV2_08_02(0,0)
Pad_e764
  round 1.7 hole 1.1: UV2_08_03(0,0)
Pad_e765
  round 1.7 hole 1.1: UV2_08_04(0,0)
Pad_e766
  round 1.7 hole 1.1: UV2_08_05(0,0)
Pad_e767
  round 1.7 hole 1.1: UV2_08_06(0,0)
Pad_e768
  round 1.7 hole 1.1: UV2_08_07(0,0)
Pad_e769
  round 1.7 hole 1.1: UV2_08_08(0,0)
Pad_e770
  round 1.7 hole 1.1: UV2_08_09(0,0)
Pad_e771
  round 1.7 hole 1.1: UV2_08_10(0,0)
Pad_e772
  round 1.7 hole 1.1: UV2_08_11(0,0)
Pad_e773
  round 1.7 hole 1.1: UV2_08_12(0,0)
Pad_e774
  round 1.7 hole 1.1: UV2_09_01(0,0)
Pad_e775
  round 1.7 hole 1.1: UV2_09_02(0,0)
Pad_e776
  round 1.7 hole 1.1: UV2_09_03(0,0)
Pad_e777
  round 1.7 hole 1.1: UV2_09_04(0,0)
Pad_e778
  round 1.7 hole 1.1: UV2_09_05(0,0)
Pad_e779
  round 1.7 hole 1.1: UV2_09_06(0,0)
Pad_e780
  round 1.7 hole 1.1: UV2_09_07(0,0)
Pad_e781
  round 1.7 hole 1.1: UV2_09_08(0,0)
Pad_e782
  round 1.7 hole 1.1: UV2_09_09(0,0)
Pad_e783
  round 1.7 hole 1.1: UV2_09_10(0,0)
Pad_e784
  round 1.7 hole 1.1: UV2_09_11(0,0)
Pad_e785
  round 1.7 hole 1.1: UV2_09_12(0,0)
Pad_e786
  round 1.7 hole 1.1: UV2_10_01(0,0)
Pad_e787
  round 1.7 hole 1.1: UV2_10_02(0,0)
Pad_e788
  round 1.7 hole 1.1: UV2_10_03(0,0)
Pad_e789
  round 1.7 hole 1.1: UV2_10_04(0,0)
Pad_e790
  round 1.7 hole 1.1: UV2_10_05(0,0)
Pad_e791
  round 1.7 hole 1.1: UV2_10_06(0,0)
Pad_e792
  round 1.7 hole 1.1: UV2_10_07(0,0)
Pad_e793
  round 1.7 hole 1.1: UV2_10_08(0,0)
Pad_e794
  round 1.7 hole 1.1: UV2_10_09(0,0)
Pad_e795
  round 1.7 hole 1.1: UV2_10_10(0,0)
Pad_e796
  round 1.7 hole 1.1: UV2_10_11(0,0)
Pad_e797
  round 1.7 hole 1.1: UV2_10_12(0,0)
Pad_e798
  round 1.7 hole 1.1: UV2_11_01(0,0)
Pad_e799
  round 1.7 hole 1.1: UV2_11_02(0,0)
Pad_e800
  round 1.7 hole 1.1: UV2_11_03(0,0)
Pad_e801
  round 1.7 hole 1.1: UV2_11_04(0,0)
Pad_e802
  round 1.7 hole 1.1: UV2_11_05(0,0)
Pad_e803
  round 1.7 hole 1.1: UV2_11_06(0,0)
Pad_e804
  round 1.7 hole 1.1: UV2_11_07(0,0)
Pad_e805
  round 1.7 hole 1.1: UV2_11_08(0,0)
Pad_e806
  round 1.7 hole 1.1: UV2_11_09(0,0)
Pad_e807
  round 1.7 hole 1.1: UV2_11_10(0,0)
Pad_e808
  round 1.7 hole 1.1: UV2_11_11(0,0)
Pad_e809
  round 1.7 hole 1.1: UV2_11_12(0,0)
Pad_e810
  round 1.7 hole 1.1: UV2_12_01(0,0)
Pad_e811
  round 1.7 hole 1.1: UV2_12_02(0,0)
Pad_e812
  round 1.7 hole 1.1: UV2_12_03(0,0)
Pad_e813
  round 1.7 hole 1.1: UV2_12_04(0,0)
Pad_e814
  round 1.7 hole 1.1: UV2_12_05(0,0)
Pad_e815
  round 1.7 hole 1.1: UV2_12_06(0,0)
Pad_e816
  round 1.7 hole 1.1: UV2_12_07(0,0)
Pad_e817
  round 1.7 hole 1.1: UV2_12_08(0,0)
Pad_e818
  round 1.7 hole 1.1: UV2_12_09(0,0)
Pad_e819
  round 1.7 hole 1.1: UV2_12_10(0,0)
Pad_e820
  round 1.7 hole 1.1: UV2_12_11(0,0)
Pad_e821
  round 1.7 hole 1.1: UV2_12_12(0,0)
Pad_e822
  round 1.7 hole 1.1: UV2_13_01(0,0)
Pad_e823
  round 1.7 hole 1.1: UV2_13_02(0,0)
Pad_e824
  round 1.7 hole 1.1: UV2_13_03(0,0)
Pad_e825
  round 1.7 hole 1.1: UV2_13_04(0,0)
Pad_e826
  round 1.7 hole 1.1: UV2_13_05(0,0)
Pad_e827
  round 1.7 hole 1.1: UV2_13_06(0,0)
Pad_e828
  round 1.7 hole 1.1: UV2_13_07(0,0)
Pad_e829
  round 1.7 hole 1.1: UV2_13_08(0,0)
Pad_e830
  round 1.7 hole 1.1: UV2_13_09(0,0)
Pad_e831
  round 1.7 hole 1.1: UV2_13_10(0,0)
Pad_e832
  round 1.7 hole 1.1: UV2_14_01(0,0)
Pad_e833
  round 1.7 hole 1.1: UV2_14_02(0,0)
Pad_e834
  round 1.7 hole 1.1: UV2_14_03(0,0)
Pad_e835
  round 1.7 hole 1.1: UV2_14_04(0,0)
Pad_e836
  round 1.7 hole 1.1: UV2_14_05(0,0)
Pad_e837
  round 1.7 hole 1.1: UV2_14_06(0,0)
Pad_e838
  round 1.7 hole 1.1: UV2_14_07(0,0)
Pad_e839
  round 1.7 hole 1.1: UV2_14_08(0,0)
Pad_e840
  round 1.7 hole 1.1: UV2_14_09(0,0)
Pad_e841
  round 1.7 hole 1.1: SP4_03_03(0,0)
Pad_e842
  round 1.7 hole 1.1: SP4_04_01(0,0)
Pad_e843
  round 1.7 hole 1.1: SP4_04_03(0,0)
Pad_e844
  round 1.7 hole 1.1: SP4_04_02(0,0)
Pad_e845
  round 1.7 hole 1.1: SP4_R03_C04_FIX(0,0)
Pad_e846
  round 1.7 hole 1.1: SP4_R03_C05_FIX(0,0)
Pad_e847
  round 1.7 hole 1.1: SP4_04_03(0,0)
Pad_e848
  round 1.7 hole 1.1: SP4_04_02(0,0)
Pad_e849
  round 1.7 hole 1.1: SP4_04_01(0,0)
Pad_e850
  round 1.7 hole 1.1: SP4_04_03(0,0)
Pad_e851
  round 1.7 hole 1.1: SP4_04_02(0,0)
Pad_e852
  round 1.7 hole 1.1: SP4_04_01(0,0)
Pad_e1032
  round 1.7 hole 1.1: SP4_04_01(0,0)
Pad_e1033
  round 1.7 hole 1.1: SP4_04_03(0,0)
Pad_e1034
  round 1.7 hole 1.1: SP4_04_02(0,0)
Pad_e1035
  round 1.7 hole 1.1: UV2_14_01(0,0)
Pad_e1036
  round 1.7 hole 1.1: UV2_13_01(0,0)
Pad_e1132
  round 2.286 hole 0.642: I_DOT(0,0)
Pad_e1135
  round 1.321 hole 0.508: LOGO_DOT1(0,0)
Pad_e1136
  round 1.321 hole 0.508: LOGO_DOT2(0,0)
Pad_e1137
  round 1.321 hole 0.508: LOGO_DOT3(0,0)
Pad_e1138
  round 1.27 hole 0.508: LOGO_DOT4(0,0)
Pad_e1139
  round 1.27 hole 0.508: LOGO_DOT5(0,0)
R0603
  rect 0.806x0.864 smd: 1(-0.753,0) 2(0.753,0)

## Nets
As in the schematic, except:
LOGO_NC: NOREF#7.LOGO_DOT1 NOREF#35.LOGO_DOT3 NOREF#48.LOGO_DOT2 NOREF#167.LOGO_DOT5 NOREF#238.LOGO_DOT4

Pads without a net: NOREF SP4_04_02; NOREF#2 UV2_07_04; NOREF#3 SP4_03_05; NOREF#4 UV2_13_08; NOREF#5 UV2_05_04; NOREF#6 UV2_04_01; NOREF#8 UV2_11_07; NOREF#9 UV2_14_02; NOREF#10 UV2_07_05; NOREF#11 UV2_08_08; NOREF#12 UV2_08_03; NOREF#13 UV2_10_03; NOREF#14 UV2_11_03; NOREF#15 UV2_10_10; NOREF#16 UV2_03_11; NOREF#17 UV2_02_10; NOREF#18 SP4_04_02; NOREF#19 SP4_01_05; NOREF#20 SP4_04_02; NOREF#21 UV2_11_11; NOREF#22 SP4_04_01; NOREF#23 UV2_10_02; NOREF#24 SP4_02_14; NOREF#25 UV2_08_01; NOREF#26 SP4_01_06; NOREF#27 UV2_13_06; NOREF#28 UV2_09_05; NOREF#29 UV2_10_01; NOREF#30 UV2_01_01; NOREF#31 UV2_01_06; NOREF#32 UV2_05_03; NOREF#33 UV2_04_03; NOREF#34 SP4_01_09; NOREF#36 SP4_01_07; NOREF#37 UV2_11_05; NOREF#38 UV2_05_09; NOREF#39 UV2_06_08; NOREF#40 SP4_01_08; NOREF#41 UV2_11_09; NOREF#42 SP4_01_16; NOREF#43 UV2_14_01; NOREF#44 SP4_01_12; NOREF#45 UV2_03_02; NOREF#46 SP4_02_03; NOREF#47 SP4_04_05; NOREF#49 UV2_14_04; NOREF#50 UV2_01_12; NOREF#51 UV2_09_02; NOREF#52 UV2_10_05; NOREF#53 UV2_09_01; NOREF#54 UV2_01_05; NOREF#55 UV2_01_10; NOREF#56 SP4_02_06; NOREF#57 SP4_03_12; NOREF#58 UV2_09_06; NOREF#59 SP4_01_15; NOREF#60 SP4_03_03; NOREF#61 SP4_04_08; NOREF#62 UV2_05_11; NOREF#63 UV2_09_10; NOREF#64 UV2_09_04; NOREF#65 UV2_03_07; NOREF#66 SP4_04_02; NOREF#67 UV2_07_06; NOREF#68 UV2_07_02; NOREF#69 SP4_01_02; NOREF#70 UV2_06_05; NOREF#71 UV2_03_05; NOREF#72 UV2_08_02; NOREF#73 SP4_04_10; NOREF#74 UV2_12_08; NOREF#75 UV2_10_07; NOREF#76 UV2_02_11; NOREF#77 UV2_09_03; NOREF#78 UV2_04_10; NOREF#79 SP4_04_04; NOREF#80 UV2_04_07; NOREF#81 UV2_02_03; NOREF#82 SP4_04_07; NOREF#83 SP4_04_01; NOREF#84 SP4_02_16; NOREF#85 SP4_04_03; NOREF#86 UV2_08_12; NOREF#87 UV2_01_11; NOREF#88 UV2_02_12; NOREF#89 SP4_02_13; NOREF#90 SP4_04_13; NOREF#91 UV2_06_06; NOREF#92 UV2_07_11; NOREF#93 UV2_13_03; NOREF#94 UV2_12_02; NOREF#95 UV2_07_01; NOREF#96 UV2_12_09; NOREF#97 SP4_04_03; NOREF#98 SP4_01_04; NOREF#99 UV2_04_11; NOREF#100 UV2_11_04; NOREF#101 UV2_09_07; NOREF#102 UV2_01_07; NOREF#103 UV2_10_09; NOREF#104 SP4_04_06; NOREF#105 UV2_04_09; NOREF#106 UV2_12_03; NOREF#107 UV2_03_08; NOREF#108 UV2_10_11; NOREF#109 MH3; NOREF#110 SP4_04_11; NOREF#111 UV2_01_02; NOREF#112 UV2_09_12; NOREF#113 SP4_03_03; NOREF#114 UV2_07_10; NOREF#115 UV2_02_09; NOREF#116 UV2_11_12; NOREF#117 UV2_05_02; NOREF#118 UV2_08_11; NOREF#119 SP4_03_09; NOREF#120 UV2_11_06; NOREF#121 UV2_14_06; NOREF#122 SP4_01_01; NOREF#123 UV2_02_07; NOREF#124 UV2_03_09; NOREF#125 UV2_09_09; NOREF#126 UV2_13_07; NOREF#127 SP4_02_07; NOREF#128 UV2_06_09; NOREF#129 SP4_02_08; NOREF#130 UV2_05_05; NOREF#131 UV2_03_01; NOREF#132 SP4_03_06; NOREF#133 UV2_08_06; NOREF#134 UV2_14_09; NOREF#135 UV2_01_09; NOREF#136 SP4_04_14; NOREF#137 UV2_14_05; NOREF#138 SP4_01_11; NOREF#139 UV2_02_06; NOREF#140 UV2_05_01; NOREF#141 UV2_04_12; NOREF#142 SP4_04_02; NOREF#143 SP4_03_04; NOREF#144 SP4_02_10; NOREF#145 UV2_06_10; NOREF#146 UV2_10_12; NOREF#147 SP4_04_09; NOREF#148 UV2_03_03; NOREF#149 UV2_13_09; NOREF#150 SP4_02_04; NOREF#151 SP4_03_14; NOREF#152 UV2_12_07; NOREF#153 UV2_13_01; NOREF#154 SP4_03_13; NOREF#155 SP4_02_05; NOREF#156 UV2_02_04; NOREF#157 SP4_03_15; NOREF#158 UV2_07_09; NOREF#159 MH1; NOREF#160 SP4_04_03; NOREF#161 UV2_10_06; NOREF#162 UV2_12_01; NOREF#163 SP4_04_12; NOREF#164 UV2_03_10; NOREF#165 UV2_14_03; NOREF#166 UV2_06_11; NOREF#168 SP4_R03_C05_FIX; NOREF#169 SP4_04_01; NOREF#170 SP4_01_14; NOREF#171 SP4_03_11; NOREF#172 UV2_12_06; NOREF#173 UV2_03_06; NOREF#174 SP4_04_03; NOREF#175 SP4_01_13; NOREF#176 UV2_12_10; NOREF#177 UV2_02_05; NOREF#178 UV2_07_03; NOREF#180 UV2_05_07; NOREF#181 UV2_08_10; NOREF#182 UV2_10_04; NOREF#183 SP4_04_16; NOREF#184 UV2_13_01; NOREF#185 UV2_06_12; NOREF#186 UV2_04_08; NOREF#187 SP4_03_07; NOREF#188 UV2_08_07; NOREF#189 SP4_02_02; NOREF#190 UV2_13_10; NOREF#191 UV2_02_02; NOREF#192 UV2_08_09; NOREF#193 UV2_12_04; NOREF#194 SP4_03_16; NOREF#195 UV2_11_08; NOREF#196 SP4_R03_C04_FIX; NOREF#197 UV2_11_10; NOREF#198 UV2_05_10; NOREF#199 UV2_13_04; NOREF#200 UV2_09_11; NOREF#201 UV2_04_06; NOREF#202 SP4_03_08; NOREF#203 UV2_07_08; NOREF#204 MH4; NOREF#205 SP4_02_11; NOREF#206 UV2_04_04; NOREF#207 UV2_12_12; NOREF#208 SP4_02_12; NOREF#209 UV2_05_06; NOREF#210 UV2_14_01; NOREF#211 UV2_03_12; NOREF#212 UV2_09_08; NOREF#213 UV2_05_12; NOREF#214 UV2_01_03; NOREF#215 UV2_11_02; NOREF#216 UV2_06_02; NOREF#217 SP4_02_15; NOREF#218 UV2_12_05; NOREF#219 UV2_03_04; NOREF#220 MH2; NOREF#221 UV2_07_12; NOREF#222 UV2_04_05; NOREF#223 UV2_05_08; NOREF#224 UV2_11_01; NOREF#225 SP4_04_01; NOREF#226 UV2_06_07; NOREF#227 UV2_12_11; NOREF#228 UV2_02_01; NOREF#229 UV2_13_02; NOREF#230 SP4_01_10; NOREF#231 SP4_02_01; NOREF#232 SP4_04_03; NOREF#233 UV2_08_05; NOREF#234 SP4_01_03; NOREF#235 SP4_04_15; NOREF#236 SP4_03_10; NOREF#237 UV2_08_04; NOREF#239 UV2_06_03; NOREF#240 UV2_10_08; NOREF#241 UV2_14_08; NOREF#242 UV2_06_04; NOREF#243 SP4_04_01; NOREF#244 SP4_02_09; NOREF#245 UV2_04_02; NOREF#246 UV2_02_08; NOREF#247 UV2_14_07; NOREF#248 UV2_07_07; NOREF#249 UV2_06_01; NOREF#250 UV2_01_04; NOREF#251 UV2_01_08; NOREF#252 UV2_13_05

## Via types
v1: diameter 0.6, hole 0.3, Top Layer to Bottom Layer, 36 vias

## Routing (per net, layer and track width the routed paths; a pad name or vN(x,y) marks a point on that pad's centre or on a via; arc(x,y) is an arc through that point)
+3V3: length 5
  Top Layer w0.406: J7.1 31.37,20.45 R7.1
  Top Layer w0.762: v1(55.83,51.62) SJ3.1 ; v1(4.06,44.83) 4.06,43.99 SJ1.1
GND: length 12
  Top Layer w0.406: 43.2,26.11 43.86,25.45 v1(43.92,25.45) ; 43.2,26.11 43.2,24.97 C1.1 C2.1 ; 43.2,26.11 U1.5 ; v1(37.97,22.48) 37.94,22.44 X1.2 ; C3.1 46.74,25.02 v1(47.75,26.03) ; C4.1 32.33,28.19 32.26,28.19 ; R11.2 32.26,28.19 ; 32.26,28.19 v1(32.26,28.58)
  Top Layer w0.762: v1(6.6,44.83) 6.6,43.99 SJ2.1 ; v1(64.9,13.08) SJ4.1
VDD_CORE: length 24.7
  Top Layer w0.406: v1(42.42,28.45) 42.42,26.77 arc(42.41,26.75) U1.4 42.4,25.57 C1.2 C2.2 ; R6.1 v1(47.69,23.37) ; v1(33.91,28.45) 33.91,28.31 R5.1 ; R7.2 v1(33.78,20.45)
  Bottom Layer w0.406: TP1.1 36.8,37.12 36.8,33.56 37.08,33.27 41.53,33.27 42.82,31.98 42.82,29.11 42.42,28.7 v1(42.42,28.45)
VDD_OSC: length 6.8
  Top Layer w0.406: R5.2 34.33,25.45 X1.4 ; X1.4 34.03,23.74 R8.1 ; X1.4 33.15,25.23 C4.2
BB_01: length 20.3
  Top Layer w0.889: BB1.5 BB1.4 BB1.3 BB1.2 BB1.1
  Bottom Layer w0.889: BB1.1 BB1.2 BB1.3 BB1.4 BB1.5
BB_02: length 20.3
  Top Layer w0.889: BB2.1 BB2.2 BB2.3 BB2.4 BB2.5
  Bottom Layer w0.889: BB2.5 BB2.4 BB2.3 BB2.2 BB2.1
BB_03: length 20.3
  Top Layer w0.889: BB3.1 BB3.2 BB3.3 BB3.4 BB3.5
  Bottom Layer w0.889: BB3.5 BB3.4 BB3.3 BB3.2 BB3.1
BB_04: length 20.3
  Top Layer w0.889: BB4.1 BB4.2 BB4.3 BB4.4 BB4.5
  Bottom Layer w0.889: BB4.1 BB4.2 BB4.3 BB4.4 BB4.5
BB_05: length 20.3
  Top Layer w0.889: BB5.5 BB5.4 BB5.3 BB5.2 BB5.1
  Bottom Layer w0.889: BB5.1 BB5.2 BB5.3 BB5.4 BB5.5
BB_06: length 20.3
  Top Layer w0.889: BB6.1 BB6.2 BB6.3 BB6.4 BB6.5
  Bottom Layer w0.889: BB6.1 BB6.2 BB6.3 BB6.4 BB6.5
BB_07: length 20.3
  Top Layer w0.889: BB7.1 BB7.2 BB7.3 BB7.4 BB7.5
  Bottom Layer w0.889: BB7.1 BB7.2 BB7.3 BB7.4 BB7.5
BB_08: length 20.3
  Top Layer w0.889: BB8.1 BB8.2 BB8.3 BB8.4 BB8.5
  Bottom Layer w0.889: BB8.5 BB8.4 BB8.3 BB8.2 BB8.1
BB_09: length 20.3
  Top Layer w0.889: BB9.1 BB9.2 BB9.3 BB9.4 BB9.5
  Bottom Layer w0.889: BB9.5 BB9.4 BB9.3 BB9.2 BB9.1
BB_10: length 20.3
  Top Layer w0.889: BB10.1 BB10.2 BB10.3 BB10.4 BB10.5
  Bottom Layer w0.889: BB10.1 BB10.2 BB10.3 BB10.4 BB10.5
BB_11: length 20.3
  Top Layer w0.889: BB11.1 BB11.2 BB11.3 BB11.4 BB11.5
  Bottom Layer w0.889: BB11.5 BB11.4 BB11.3 BB11.2 BB11.1
BB_12: length 20.3
  Top Layer w0.889: BB12.1 BB12.2 BB12.3 BB12.4 BB12.5
  Bottom Layer w0.889: BB12.1 BB12.2 BB12.3 BB12.4 BB12.5
BB_PWR_A: length 38.1
  Top Layer w0.889: BBP1.8 BBP1.7 BBP1.6 BBP1.5 BBP1.4 BBP1.3 BBP1.2 BBP1.1 SJ1.2
  Bottom Layer w0.889: BBP1.8 BBP1.7 BBP1.6 BBP1.5 BBP1.4 BBP1.3 BBP1.2 BBP1.1
BB_PWR_B: length 38.1
  Top Layer w0.889: SJ2.2 BBP2.1 BBP2.2 BBP2.3 BBP2.4 BBP2.5 BBP2.6 BBP2.7 BBP2.8
  Bottom Layer w0.889: BBP2.1 BBP2.2 BBP2.3 BBP2.4 BBP2.5 BBP2.6 BBP2.7 BBP2.8
BB_PWR_C: length 38.1
  Top Layer w0.889: BBP3.8 78.55,51.62 SJ3.2
  Bottom Layer w0.889: 60.77,51.5 78.55,51.5
BB_PWR_D: length 38.1
  Top Layer w0.889: SJ4.2 BBP4.1 BBP4.2 BBP4.3 BBP4.4 BBP4.5 BBP4.6 BBP4.7 BBP4.8
  Bottom Layer w0.889: 69.79,13.21 87.57,13.21
CV_E1_PA0: length 18.1
  Top Layer w0.203: U1.7 44.8,27.46 44.45,27.81 44.45,28.7 45.59,29.84 45.59,32.06 v1(45.27,32.39)
  Top Layer w0.762: J2.1 J9.1
  Bottom Layer w0.203: J2.1 51.37,38.48 v1(45.27,32.39)
CV_E2_PA1: length 16.1
  Top Layer w0.203: U1.8 45.45,26.9 45.45,28.14 v1(45.25,28.34)
  Top Layer w0.762: J2.2 J9.2
  Bottom Layer w0.203: v1(45.25,28.34) 45.36,28.34 45.97,28.96 45.97,32.26 49.66,35.94 J2.2
CV_E3_PA2: length 12
  Top Layer w0.203: U1.9 47.76,28.19 v1(48.13,27.81)
  Top Layer w0.762: J2.3 J9.3
  Bottom Layer w0.203: 48.13,27.81 48.13,30.1 49.21,31.18 49.21,32.5 50.12,33.4 J2.3
CV_E4_PA3: length 8.4
  Top Layer w0.203: v1(50.08,28.88) 50.03,28.82 47.21,28.82 U1.10
  Top Layer w0.762: J2.4 J9.4
  Power / Signal w0.203: v1(50.08,28.88) 50.08,29 J2.4
CV_E5_PA4: length 8
  Top Layer w0.203: U1.11 47.36,29.47 50.8,29.47 J2.5
  Top Layer w0.762: J2.5 J9.5
CV_E6_PA5: length 10.3
  Top Layer w0.203: v1(49.07,30.06) 48.54,30.59 U1.12
  Top Layer w0.762: J2.6 J9.6
  Bottom Layer w0.203: J2.6 49.07,28.66 v1(49.07,30.06)
CV_E7_PA6: length 14.1
  Top Layer w0.203: U1.13 47.98,31.39 v1(48.19,31.19)
  Top Layer w0.762: J2.7 J9.7
  Bottom Layer w0.203: v1(48.19,31.19) 47.58,30.58 47.58,27.1 51.44,23.24 J2.7
CV_E8_PA7: length 18.7
  Top Layer w0.203: v1(50.14,31.86) 49.97,32.03 48.16,32.03 48,32.19 U1.14
  Top Layer w0.762: J2.8 J9.8
  Power / Signal w0.203: J2.8 51.94,21.61 48.9,24.66 48.9,28.58 50.14,29.82 v1(50.14,31.86)
CV_N5_PA11: length 8.4
  Top Layer w0.203: U1.22 41.6,36.37 arc(41.64,36.47) v1(41.74,36.51)
  Top Layer w0.762: J8.5 J1.5
  Bottom Layer w0.203: J1.5 41.78,36.55 arc(41.77,36.52) v1(41.74,36.51)
CV_N6_PA12: length 10.5
  Top Layer w0.203: J1.6 43.94,41.02 42.68,39.76 41.78,39.76 41.78,37.34 40.8,36.35 U1.23
  Top Layer w0.762: J8.6 J1.6
CV_N7_PB8: length 20.2
  Top Layer w0.203: v1(44.13,31.31) 42.15,29.34 40.39,29.34 39.24,28.19 38.56,28.19
  Top Layer w0.762: J8.7 J1.7
  Bottom Layer w0.203: v1(44.13,31.31) 44.13,34.6 46.75,37.22 46.75,40.91 J1.7
CV_N8: length 2.5
  Top Layer w0.762: J8.8 J1.8
CV_S1_PA8: length 23
  Top Layer w0.203: J3.1 47.75,19.81 46.61,19.81 v1(45.49,20.94) ; v1(44.86,30.13) 44.86,30.45 44.81,30.5 44.81,31.54 44.58,31.77 44.58,34.04 44.8,34.26 U1.18 44.84,35.19
  Top Layer w0.762: J3.1 J10.1
  Bottom Layer w0.203: v1(44.86,30.13) 44.86,29.36 44.2,28.7 44.2,26.16 45.47,24.89 45.47,20.96 v1(45.49,20.94)
CV_S2_PB0: length 19.1
  Top Layer w0.203: U1.15 47.98,32.99 v1(48.39,32.58)
  Top Layer w0.762: J3.2 J10.2
  Bottom Layer w0.203: v1(48.39,32.58) 46.86,31.05 J3.2
CV_S3_PB1: length 22.8
  Top Layer w0.203: v1(48.91,33.88) 48.82,33.79 U1.16 46.3,33.79
  Top Layer w0.762: J3.3 J10.3
  Bottom Layer w0.203: J3.3 46.48,20.32 46.48,31.46 48.9,33.88 v1(48.91,33.88)
CV_S4_PC6: length 20.4
  Top Layer w0.203: v1(41.79,31.5) 43.2,32.92 U1.20
  Top Layer w0.762: J3.4 J10.4
  Bottom Layer w0.203: J3.4 41.78,27.94 41.66,28.07 41.66,29.08 41.91,29.34 41.91,31.38 v1(41.79,31.5)
CV_S5_PB2: length 23.9
  Top Layer w0.203: J3.5 41.4,20.32 43.41,20.32 45.8,22.72 45.8,25.56 46.21,25.96 46.21,27.59 45.94,27.85 45.94,34.88 U1.17
  Top Layer w0.762: J3.5 J10.5
CV_S6_PB9: length 13.5
  Top Layer w0.203: U1.1 39.52,27.22 v1(39.44,27.22)
  Top Layer w0.762: J3.6 J10.6
  Bottom Layer w0.203: v1(39.44,27.22) 39.44,25.27 38.7,24.53 38.7,22.08 38.5,21.88 38.5,19.96 J3.6
CV_S7_PC14: length 9.3
  Top Layer w0.203: R3.1 38.87,19.32 36.22,19.32 35.07,18.16 J3.7
  Top Layer w0.762: J3.7 J10.7
CV_S8_PC15: length 13.3
  Top Layer w0.203: J3.8 32.53,18.16 34.04,19.67 36.3,19.67 40.13,23.5
  Top Layer w0.762: J3.8 J10.8
CV_W1_PA9: length 25
  Top Layer w0.203: v1(40.89,30.28) 41.59,30.28 44,32.7 U1.19
  Top Layer w0.762: J4.1 J11.1
  Bottom Layer w0.203: v1(40.89,30.28) 31.3,20.7 J4.1
CV_W2_PA10: length 21.7
  Top Layer w0.203: v1(40.17,31.79) 42.4,34.02 U1.21
  Top Layer w0.762: J4.2 J11.2
  Bottom Layer w0.203: J4.2 31.27,25.43 34.06,25.43 40.17,31.54 v1(40.17,31.79)
CV_W3_PB6: length 13.8
  Top Layer w0.203: 38.56,29.79 38.49,29.72 37.34,29.72 v1(37.21,29.84)
  Top Layer w0.762: J4.3 J11.3
  Bottom Layer w0.203: v1(37.21,29.84) 36.09,29.84 32.03,25.78 J4.3
CV_W4_PB7: length 12.4
  Top Layer w0.203: J4.4 31.22,28.32 32.03,29.13 37.77,29.13 37.91,28.99 38.56,28.99
  Top Layer w0.762: J4.4 J11.4
CV_W5_PB3: length 12.6
  Top Layer w0.203: 38.56,32.19 30.41,32.19 J4.5
  Top Layer w0.762: J4.5 J11.5
CV_W6_PB4: length 12.9
  Top Layer w0.203: 38.56,31.39 38.47,31.3 v1(34.24,31.3)
  Top Layer w0.762: J4.6 J11.6
  Bottom Layer w0.203: J4.6 30.48,32 33.54,32 v1(34.24,31.3)
CV_W7_PB5: length 15.4
  Top Layer w0.203: v1(35.96,30.75) 36.13,30.59 38.56,30.59
  Top Layer w0.762: J4.7 J11.7
  Bottom Layer w0.203: J4.7 30.59,34.43 30.59,32.5 30.73,32.36 34.35,32.36 v1(35.96,30.75)
